# EasyEDA Pro project ProPrj_EBS_2026-01-24.epro

# Schematic Schematic1
Create Date: 2026-01-24; Page Name: P1; Project Name: EBS; Schematic Name: Schematic1; Update Date: 2026-01-25; Company: 嘉立创EDA; Page Size: A4; Version: V1.0
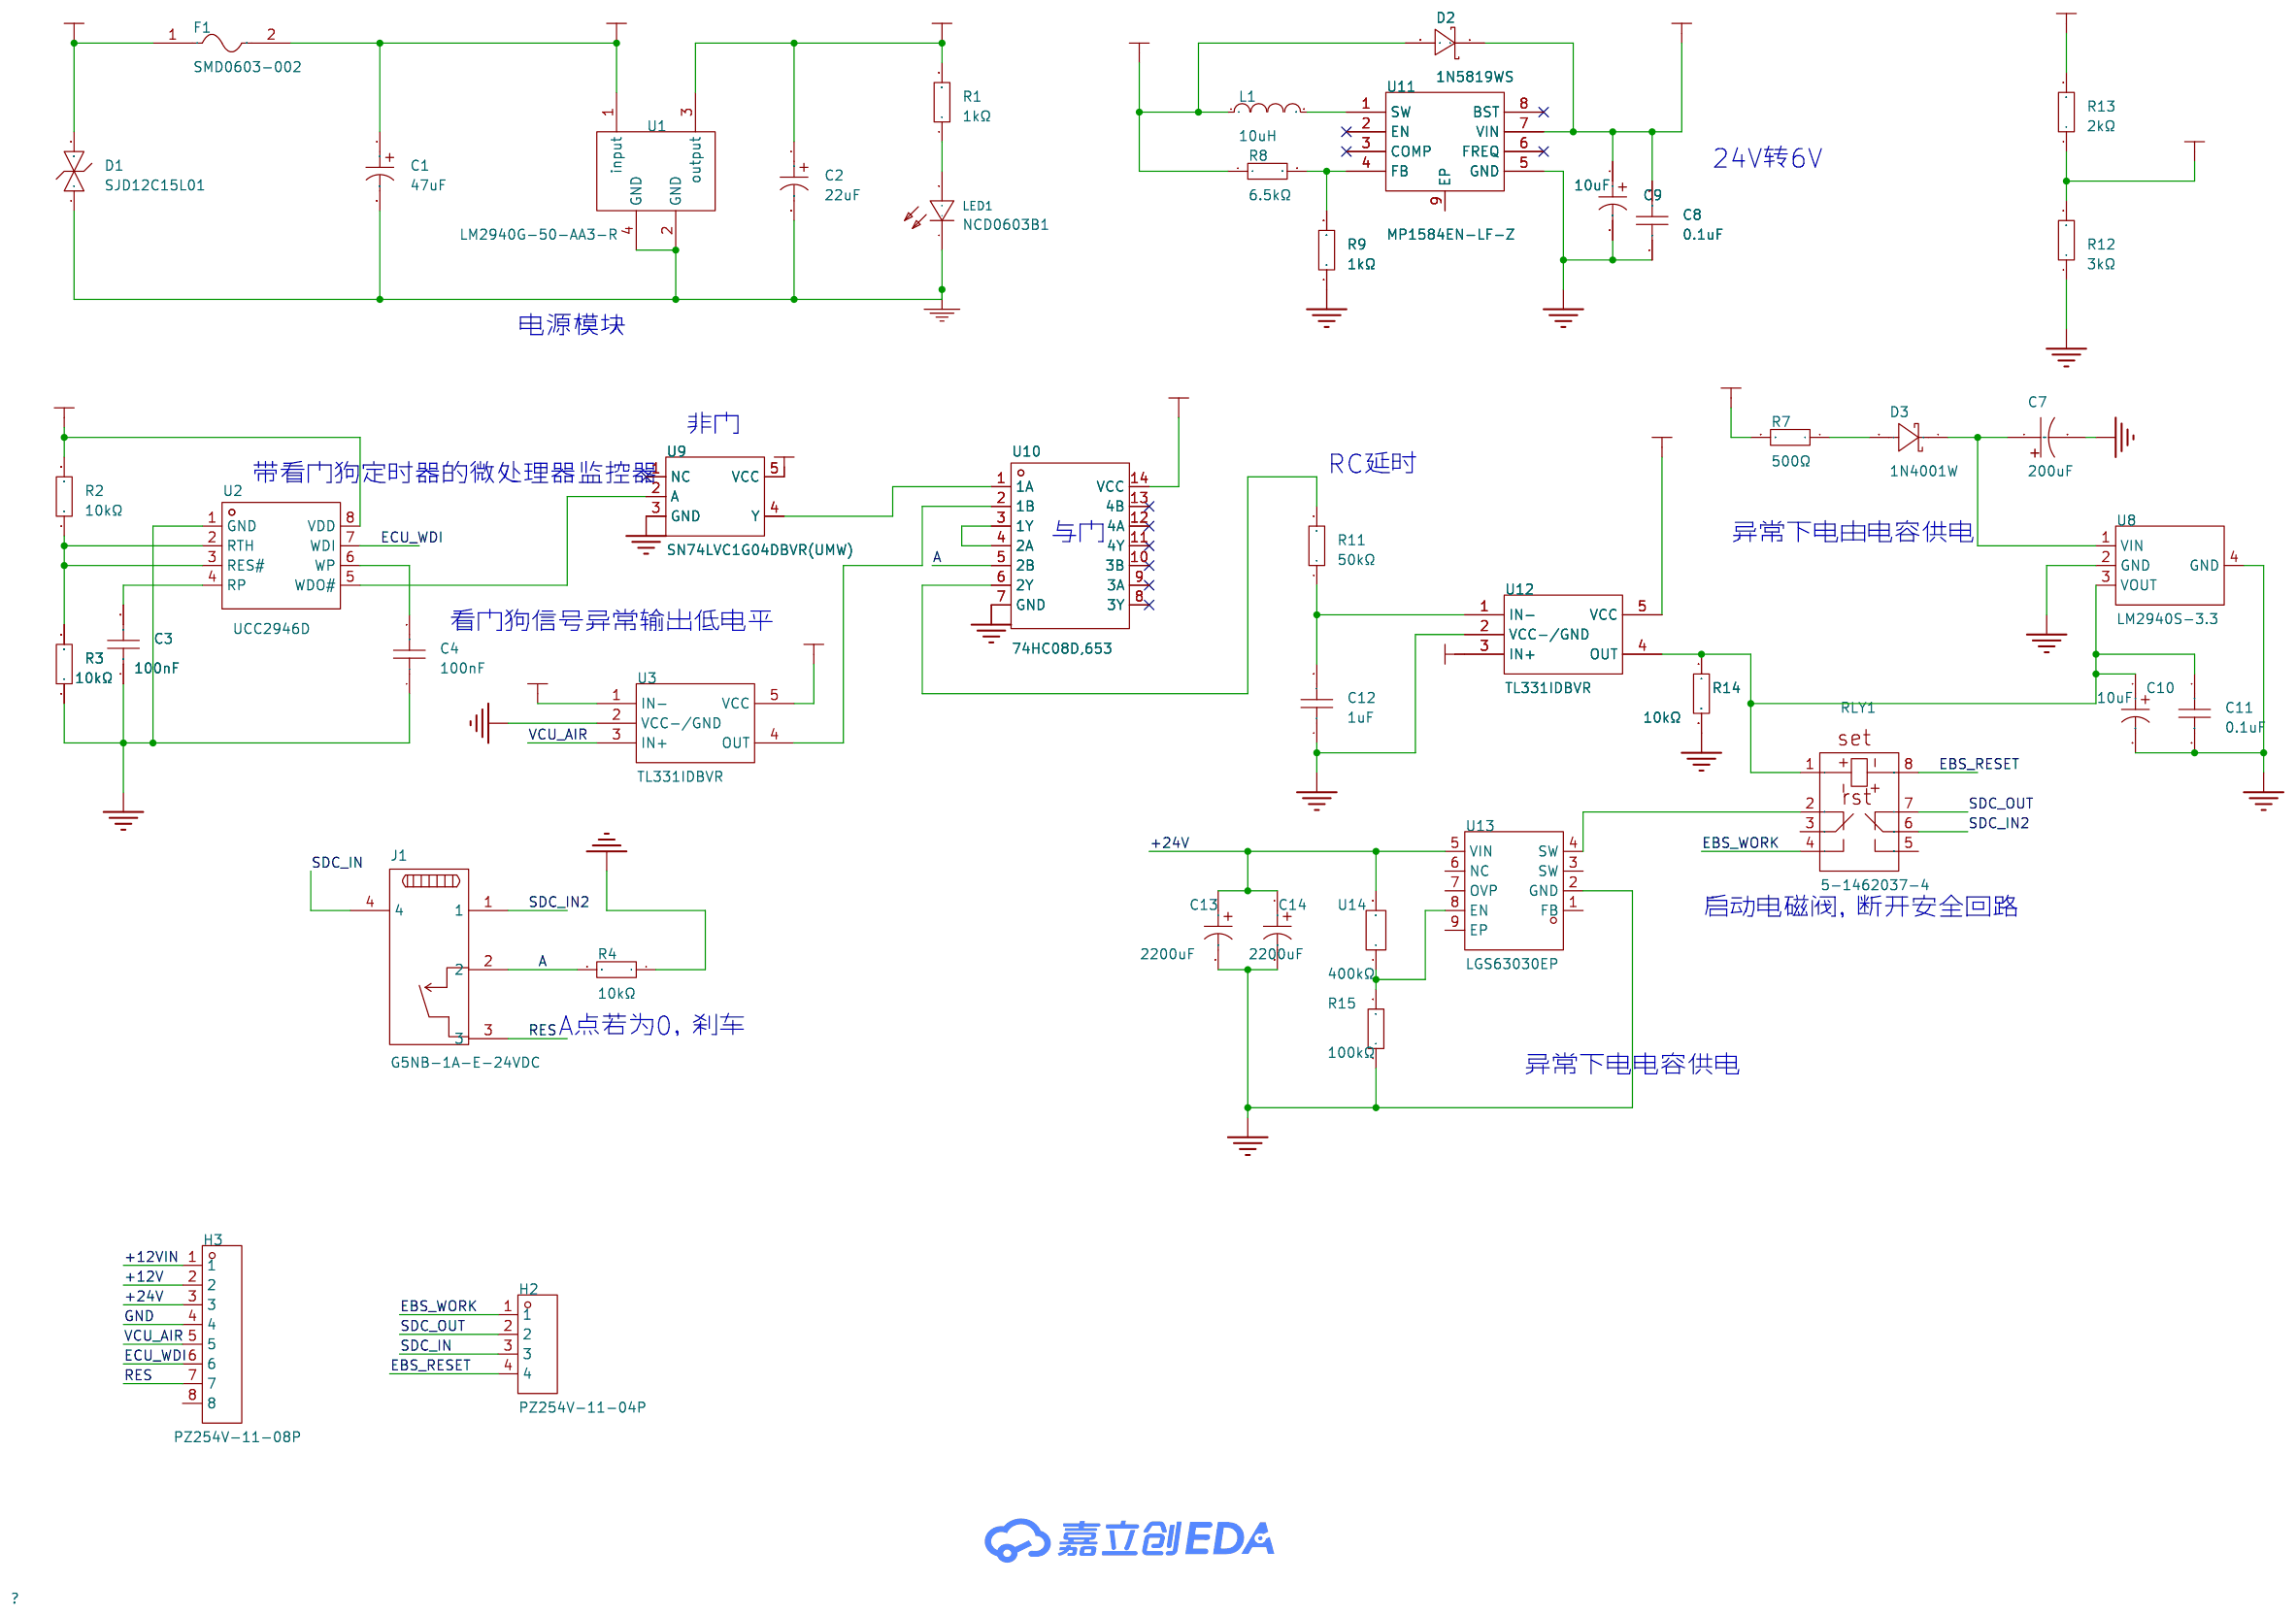
[diagram p0: schematic sheet]

## Parts
C1  47uF  [CAP-SMD_BD5.0-L5.3-W5.3-LS5.9-FD]
C2  22uF  [CAP-SMD_BD4.0-L4.3-W4.3-FD_1]
C3  100nF  [C0603]
C4  100nF  [C0603]
C7  200uF  [CAP-TH_BD12.5-P5.00-D0.6-FD]
C8  0.1uF  [C0603]
C9  10uF  [CAP-SMD_BD6.3-L6.6-W6.6-LS7.3-FD-H7.7]
C10  10uF  [CAP-SMD_BD6.3-L6.6-W6.6-LS7.3-FD-H7.7]
C11  0.1uF  [C0603]
C12  1uF  [C0603]
C13  2200uF  [CAP-SMD_BD16.0-L17.0-W17.0-FD]
C14  2200uF  [CAP-SMD_BD16.0-L17.0-W17.0-FD]
D1  SJD12C15L01  [SOD-123_L2.7-W1.6-LS3.7-BI]
D2  1N5819WS  [SOD-323_L1.8-W1.3-LS2.5-RD]
D3  1N4001W  [SOD-123FL_L2.7-W1.8-LS3.8-RD]
F1  SMD0603-002  [F0603]
H2  PZ254V-11-04P  [HDR-TH_4P-P2.54-V-M]
H3  PZ254V-11-08P  [HDR-TH_8P-P2.54-V-M]
J1  G5NB-1A-E-24VDC  [RELAY-TH_G5NB-1A-E-24VDC]
L1  10uH  [IND-SMD_L4.0-W4.0]
LED1  NCD0603B1  [LED0603-RD]
R1  1kΩ  [R0603]
R2  10kΩ  [R0603]
R3  10kΩ  [R0603]
R4  10kΩ  [R0603]
R7  500Ω  [R0603]
R8  6.5kΩ  [R0603]
R9  1kΩ  [R0603]
R11  50kΩ  [R0603]
R12  3kΩ  [R0603]
R13  2kΩ  [R0603]
R14  10kΩ  [R0603]
R15  100kΩ  [R0603]
RLY1  5-1462037-4  [RELAY-SMD_8P-L10.0-W6.0_IM43GR]
U1  LM2940G-50-AA3-R  [SOT-223-4_L6.5-W3.5-P2.30-LS7.0-BR]
U2  UCC2946D  [SOIC-8_L4.9-W3.9-P1.27-LS6.0-BL]
U3  TL331IDBVR  [SOT-23-5_L3.0-W1.7-P0.95-LS2.8-BR]
U8  LM2940S-3.3  [SOT-223-3_L6.5-W3.4-P2.30-LS7.0-BR]
U9  SN74LVC1G04DBVR(UMW)  [SOT-23-5_L3.0-W1.7-P0.95-LS2.8-BR]
U10  74HC08D,653  [SOIC-14_L8.7-W3.9-P1.27-LS6.0-BL]
U11  MP1584EN-LF-Z  [SOIC-8_L5.0-W4.0-P1.27-LS6.0-BL-EP2.0]
U12  TL331IDBVR  [SOT-23-5_L3.0-W1.7-P0.95-LS2.8-BR]
U13  LGS63030EP  [SOP-8_L4.9-W3.9-P1.27-LS6.0-TL-EP]
U14  400kΩ  [R0805]

## Library data of the parts
C1 = JVJ25V47M5x5: 容值:47uF;精度:±20%;额定电压:25V;纹波电流:35mA@120Hz;; LCSC Part Name: 47uF ±20% 25V; Supplier Part: C46550408; Manufacturer: JIERR(捷而瑞); Supplier Footprint: SMD,D5xL5.4mm; JLCPCB Part Class: 扩展库; Datasheet: https://item.szlcsc.com/datasheet/JVJ25V47M5x5/48680102.html; Supplier: LCSC; Tolerance: ±20%; Voltage Rating: 25V; Ripple Current: 35mA@120Hz; Diameter: 5mm; Height - Seated (Max): 5.4mm; Lifetime: 2000hrs@105℃; Operating Temperature: -55℃~+105℃
C2 = JVJ16V22M4X5: 容值:22uF;精度:±20%;额定电压:16V;纹波电流:20mA@120Hz;; LCSC Part Name: 22uF ±20% 16V; Supplier Part: C46550398; Manufacturer: JIERR(捷而瑞); Supplier Footprint: SMD,D4xL5.4mm; JLCPCB Part Class: 扩展库; Datasheet: https://item.szlcsc.com/datasheet/JVJ16V22M4X5/48680092.html; Supplier: LCSC; Tolerance: ±20%; Voltage Rating: 16V; Ripple Current: 20mA@120Hz; Diameter: 4mm; Height - Seated (Max): 5.4mm; Lifetime: 2000hrs@105℃; Operating Temperature: -55℃~+105℃
C3 C4 C8 C11 = CC0603KRX7R9BB104: 容值:100nF;精度:±10%;额定电压:50V;温度系数:X7R;; LCSC Part Name: 100nF ±10% 50V; Supplier Part: C14663; Manufacturer: YAGEO(国巨); Supplier Footprint: 0603; JLCPCB Part Class: 基础库; Datasheet: https://item.szlcsc.com/datasheet/CC0603KRX7R9BB104/15331.html; Supplier: LCSC; Tolerance: ±10%; Voltage Rating: 50V; Temperature Coefficient: X7R
C7 = LKML1602A201MF: 容值:200uF;精度:±20%;额定电压:100V;纹波电流:-;等效串联电阻(ESR):-;; LCSC Part Name: 200uF ±20% 100V; Supplier Part: C443147; Manufacturer: Ymin(永铭); Supplier Footprint: 插件,D12.5xL16mm; JLCPCB Part Class: 扩展库; Supplier: LCSC; Tolerance: ±20%; Voltage Rating: 100V; Pin Spacing: 5mm; Diameter: 12.5mm; Height - Seated (Max): 16mm; Lifetime: 10000hrs@105℃
C9 C10 = JVJ50V100M6x8: 容值:100uF;精度:±20%;额定电压:50V;纹波电流:140mA@120Hz;; LCSC Part Name: 100uF ±20% 50V; Supplier Part: C46550415; Manufacturer: JIERR(捷而瑞); Supplier Footprint: SMD,D6.3xL7.7mm; JLCPCB Part Class: 扩展库; Datasheet: https://item.szlcsc.com/datasheet/JVJ50V100M6x8/48680109.html; Supplier: LCSC; Tolerance: ±20%; Voltage Rating: 50V; Ripple Current: 140mA@120Hz; Diameter: 6.3mm; Height - Seated (Max): 7.7mm; Lifetime: 2000hrs@105℃; Operating Temperature: -55℃~+105℃
C12 = CGA0603X5R105K500JT: 容值:1uF;精度:±10%;额定电压:50V;温度系数:X5R;; LCSC Part Name: 1uF ±10% 50V; Supplier Part: C6119852; Manufacturer: HRE(芯声); Supplier Footprint: 0603; JLCPCB Part Class: 扩展库; Datasheet: https://item.szlcsc.com/datasheet/CGA0603X5R105K500JT/7062558.html; Supplier: LCSC; Tolerance: ±10%; Voltage Rating: 50V; Temperature Coefficient: X5R
C13 C14 = JVJ25V2200M16X16: 容值:2200uF;精度:±20%;额定电压:25V;纹波电流:900mA@120Hz;; LCSC Part Name: 2200uF ±20% 25V; Supplier Part: C49256852; Manufacturer: JIERR(捷而瑞); Supplier Footprint: SMD,D16xL16.5mm; JLCPCB Part Class: 扩展库; Datasheet: https://item.szlcsc.com/datasheet/JVJ25V2200M16X16/51692252.html; Supplier: LCSC; Tolerance: ±20%; Voltage Rating: 25V; Ripple Current: 900mA@120Hz; Diameter: 16mm; Height - Seated (Max): 16.5mm; Lifetime: 2000hrs@105℃
D1 = SJD12C15L01: 反向截止电压(Vrwm):15V;击穿电压(VBR):16.7V;峰值脉冲电流(Ipp)@8/20us:8.2A;钳位电压(Vc)@Ipp:24.4V;; Supplier Part: C78437; Manufacturer: Brightking(君耀电子); Supplier Footprint: SOD-123; JLCPCB Part Class: Extended Part; Datasheet: https://atta.szlcsc.com/upload/public/pdf/source/20160709/1468031891025.pdf; Supplier: LCSC; Reverse Stand-Off Voltage (Vrwm): 15V; Breakdown Voltage (VBR): 16.7V; Peak Pulse Current(Ipp)@8/20us: 8.2A; Clamping Voltage@Ipp: 24.4V
D2 = 1N5819WS_C191023: 正向压降(Vf):600mV@1A;直流反向耐压(Vr):40V;整流电流:1A;; LCSC Part Name: 电压:40V 电流:1A; Supplier Part: C191023; Manufacturer: Hottech(合科泰); Supplier Footprint: SOD-323; JLCPCB Part Class: 基础库; Datasheet: https://item.szlcsc.com/datasheet/1N5819WS/213850.html; Supplier: LCSC; Voltage - Forward(Vf@If): 600mV@1A; Voltage - DC Reverse(Vr): 40V; Current - Rectified: 1A; Non-Repetitive Peak Forward Surge Current: 25A
D3 = 1N4001W_C18199085: 二极管配置:独立式;正向压降(Vf):1V@1.0A;直流反向耐压(Vr):50V;整流电流:1A;; Supplier Part: C18199085; Manufacturer: R+O(宏嘉诚); Supplier Footprint: SOD-123FL; JLCPCB Part Class: 扩展库; Datasheet: https://item.szlcsc.com/datasheet/1N4001W/19354317.html; Supplier: LCSC; Diode Configuration: 独立式; Voltage - Forward(Vf@If): 1V@1.0A; Voltage - DC Reverse(Vr): 50V; Current - Rectified: 1A; Reverse Leakage Current (Ir): 2uA@50V; Non-Repetitive Peak Forward Surge Current: 30A; Operating Junction Temperature Range: -55℃~+150℃
F1 = SMD0603-002: 30V,0.02A; LCSC Part Name: 20mA,30V; Supplier Part: C3646886; Manufacturer: 台湾陆海; Supplier Footprint: 0603; JLCPCB Part Class: Extended Part; Datasheet: https://atta.szlcsc.com/upload/public/pdf/source/20230404/20B4F423E9D21310C61C06C0FA62271A.pdf; Supplier: LCSC
H2 = PZ254V-11-04P: 插针结构:1x4P;间距:2.54mm;行距:-;圆针/方针:方针;安装方式:直插;排数:单排;总PIN位数:4P;额定电流:3A;额定电压:250V;配合针长度:6mm;塑高:2.5mm;端接针长度:3mm;触头材质:-;工作温度:-40℃~+105℃;颜色:黑色;; LCSC Part Name: 1x4P 间距:2.54mm 方针 直插; Supplier Part: C2691448; Manufacturer: XFCN(兴飞); Supplier Footprint: 插件,P=2.54mm; JLCPCB Part Class: 扩展库; Datasheet: https://item.szlcsc.com/datasheet/PZ254V-11-04P/2801085.html; Supplier: LCSC; Pin Structure: 1x4P; Pitch: 2.54mm; Circluar Pins/Square Pins: 方针; Mounting Type: 直插; Number of Rows: 单排; Number of Pins: 4P; Current Rating: 3A; Voltage Rating (Max): 250V; Length of Mating Pin: 6mm; Insulation Height: 2.5mm; Length of End Connection Pin: 3mm; Operating Temperature: -40℃~+105℃; Color: 黑色
H3 = PZ254V-11-08P: 插针结构:1x8P;间距:2.54mm;行距:-;圆针/方针:方针;安装方式:直插;排数:单排;总PIN位数:8P;额定电流:-;额定电压:-;配合针长度:6mm;塑高:2.5mm;端接针长度:3mm;触头材质:黄铜;触头镀层:-;工作温度:-40℃~+105℃;颜色:黑色;; LCSC Part Name: 1x8P 间距:2.54mm 方针 直插; Supplier Part: C492407; Manufacturer: XFCN(兴飞); Supplier Footprint: 插件,P=2.54mm; JLCPCB Part Class: 扩展库; Datasheet: https://item.szlcsc.com/datasheet/PZ254V-11-08P/502963.html; Supplier: LCSC; Pin Structure: 1x8P; Pitch: 2.54mm; Circluar Pins/Square Pins: 方针; Mounting Type: 直插; Number of Rows: 单排; Number of Pins: 8P; Length of Mating Pin: 6mm; Insulation Height: 2.5mm; Length of End Connection Pin: 3mm; Contact Material: 黄铜; Operating Temperature: -40℃~+105℃; Color: 黑色
J1 = G5NB-1A-E-24VDC: 线圈电压:24V;触点形式:一组常开:1A(单刀单掷-常开);触点容量(电阻负载):5A@250VAC；3A@30VDC;最大切换电压:250V@AC；30V@DC;最大切换电流:5A;; LCSC Part Name: 功率继电器 耐冲击电压10kV的1极3A开闭的小型继电器; Supplier Part: C34758; Manufacturer: OMRON(欧姆龙); Supplier Footprint: 插件,20.4x7mm; JLCPCB Part Class: 扩展库; Datasheet: https://item.szlcsc.com/datasheet/G5NB-1A-E-24VDC/35729.html; Supplier: LCSC; Coil Voltage: 24V; Contact Form: 一组常开:1A(单刀单掷-常开); Number of Pins: 4; Contact Rating: 5A@250VAC；3A@30VDC; Switching Voltage(Max): 250V@AC；30V@DC; Coil Rated Power: 200mW; Contact Material: 银合金(无镉); Switching Current(Max): 5A; Coil Type: 无极性-单线圈; Coil Resistance: 2.88kΩ; Contact Resistance: 100mΩ; Operate Time: 10ms; Release Time: 10ms; Operating Temperature: -40℃~+85℃
L1 = FHD4020S-100MT: 电感值:10uH;精度:±20%;额定电流:2.35A;饱和电流(Isat):3.5A;类型:-;; LCSC Part Name: 10uH ±20% 3.5A; Supplier Part: C602032; Manufacturer: cjiang(长江微电); Supplier Footprint: SMD,4x4mm; JLCPCB Part Class: 扩展库; Datasheet: https://item.szlcsc.com/datasheet/FHD4020S-100MT/631462.html; Supplier: LCSC; Tolerance: ±20%; Current Rating: 2.35A; Current - Saturation(Isat): 3.5A; DC Resistance(DCR): 190mΩ
LED1 = NCD0603B1: 发光颜色:蓝灯;; LCSC Part Name: 蓝灯; Supplier Part: C84266; Manufacturer: 国星光电; Supplier Footprint: 0603; JLCPCB Part Class: 扩展库; Datasheet: https://atta.szlcsc.com/upload/public/pdf/source/20200820/C84266_6A3CDBEFA72C6CAD68EDA53474ADAE6C.pdf; Supplier: LCSC; Emitted Color: 蓝灯
R1 R4 R7-R9 = 0603WAF1001T5E: 电阻类型:厚膜电阻;阻值:1kΩ;精度:±1%;功率:100mW;; LCSC Part Name: 1kΩ ±1% 100mW; Supplier Part: C21190; Manufacturer: UNI-ROYAL(厚声); Supplier Footprint: 0603; JLCPCB Part Class: Basic Part; Datasheet: https://atta.szlcsc.com/upload/public/pdf/source/20200306/C422600_1E6D84923E4A46A82E41ADD87F860B5C.pdf; Supplier: LCSC; Type: 厚膜电阻; Tolerance: ±1%; Power(Watts): 100mW; Temperature Coefficient: ±100ppm/℃; Overload Voltage (Max): 75V; Operating Temperature Range: -55℃~+155℃
R2 R3 R14 = 0603WAF1002T5E: 电阻类型:厚膜电阻;阻值:10kΩ;精度:±1%;功率:100mW;工作电压:75V;温度系数:±100ppm/℃;; LCSC Part Name: 厚膜电阻 10kΩ ±1% 100mW; Supplier Part: C25804; Manufacturer: UNI-ROYAL(厚声); Supplier Footprint: 0603; JLCPCB Part Class: 基础库; Datasheet: https://item.szlcsc.com/datasheet/0603WAF1002T5E/26547.html; Supplier: LCSC; Type: 厚膜电阻; Tolerance: ±1%; Power(Watts): 100mW; Voltage-Supply(Max): 75V; Temperature Coefficient: ±100ppm/℃; Operating Temperature: -55℃~+155℃
R11 = AR03BTC5002A: 电阻类型:薄膜电阻;阻值:50kΩ;精度:±0.1%;功率:62.5mW;工作电压:50V;温度系数:±25ppm/℃;; LCSC Part Name: 50kΩ ±0.1% 62.5mW; Supplier Part: C304067; Manufacturer: Viking(光颉); Supplier Footprint: 0603; JLCPCB Part Class: 扩展库; Datasheet: https://item.szlcsc.com/datasheet/AR03BTC5002A/288134.html; Supplier: LCSC; Type: 薄膜电阻; Tolerance: ±0.1%; Power(Watts): 62.5mW; Voltage-Supply(Max): 50V; Temperature Coefficient: ±25ppm/℃; Operating Temperature: -55℃~+155℃
R12 = 0603WAF3001T5E: 电阻类型:厚膜电阻;阻值:3kΩ;精度:±1%;功率:100mW;工作电压:75V;温度系数:±100ppm/℃;; LCSC Part Name: 3kΩ ±1% 100mW 厚膜电阻; Supplier Part: C4211; Manufacturer: UNI-ROYAL(厚声); Supplier Footprint: 0603; JLCPCB Part Class: 基础库; Datasheet: https://item.szlcsc.com/datasheet/0603WAF3001T5E/4618.html; Supplier: LCSC; Type: 厚膜电阻; Tolerance: ±1%; Power(Watts): 100mW; Voltage-Supply(Max): 75V; Temperature Coefficient: ±100ppm/℃; Operating Temperature: -55℃~+155℃
R13 = 0603WAF2001T5E: 电阻类型:厚膜电阻;阻值:2kΩ;精度:±1%;功率:100mW;工作电压:75V;温度系数:±100ppm/℃;; LCSC Part Name: 2kΩ ±1% 100mW 厚膜电阻; Supplier Part: C22975; Manufacturer: UNI-ROYAL(厚声); Supplier Footprint: 0603; JLCPCB Part Class: 基础库; Datasheet: https://item.szlcsc.com/datasheet/0603WAF2001T5E/23702.html; Supplier: LCSC; Type: 厚膜电阻; Tolerance: ±1%; Power(Watts): 100mW; Voltage-Supply(Max): 75V; Temperature Coefficient: ±100ppm/℃; Operating Temperature: -55℃~+155℃
R15 = 0603WAF1003T5E: 电阻类型:厚膜电阻;阻值:100kΩ;精度:±1%;功率:100mW;工作电压:75V;温度系数:±100ppm/℃;; LCSC Part Name: 100kΩ ±1% 100mW 厚膜电阻; Supplier Part: C25803; Manufacturer: UNI-ROYAL(厚声); Supplier Footprint: 0603; JLCPCB Part Class: 基础库; Datasheet: https://item.szlcsc.com/datasheet/0603WAF1003T5E/26546.html; Supplier: LCSC; Type: 厚膜电阻; Tolerance: ±1%; Power(Watts): 100mW; Voltage-Supply(Max): 75V; Temperature Coefficient: ±100ppm/℃; Operating Temperature: -55℃~+155℃
RLY1 = 5-1462037-4: 线圈电压:3V;触点形式:两组转换:2C(双刀双掷-转换);触点容量(电阻负载):-;最大切换电压:250V@AC；220V@DC;最大切换电流:2A;; LCSC Part Name: 3V 2A 两组转换:2C(双刀双掷-转换); Supplier Part: C377684; Manufacturer: TE Connectivity(泰科电子); Supplier Footprint: SMD,10x6mm; JLCPCB Part Class: 扩展库; Datasheet: https://item.szlcsc.com/datasheet/5-1462037-4/350541.html; Supplier: LCSC; Coil Voltage: 3V; Contact Form: 两组转换:2C(双刀双掷-转换); Switching Voltage(Max): 250V@AC；220V@DC; Coil Type: 单线圈; Switching Current(Max): 2A; Operate Time: 3ms; Release Time: 3ms; Operating Temperature: -40℃~+85℃
U1 = LM2940G-50-AA3-R: 输出类型:固定;输出极性:正;输出通道数:1;最大输入电压:26V;输出电压:5V;压差:800mV@(1A);输出电流:1A;电源纹波抑制比(PSRR):72dB@(120Hz);; LCSC Part Name: 正 Vin=26V Vout=5V 1A 72dB@(120Hz); Supplier Part: C71094; Manufacturer: UTC(友顺); Supplier Footprint: SOT-223-4; JLCPCB Part Class: Extended Part; Datasheet: https://atta.szlcsc.com/upload/public/pdf/source/20160416/1460799393051.pdf; Supplier: LCSC; Output Type: 固定; Output Polarity: 正; Number of Outputs: 1; Maximum Input Voltage: 26V; Output Voltage: 5V; Dropout Voltage: 800mV@(1A); Output Current: 1A; Power Supply Rejection Ratio (PSRR): 72dB@(120Hz)
U2 = UCC2946D: UCC2946 带看门狗定时器的微处理器监控器; Supplier Part: C201595; Manufacturer: TI(德州仪器); Supplier Footprint: SOIC-8-150mil; JLCPCB Part Class: Extended Part; Datasheet: https://atta.szlcsc.com/upload/public/pdf/source/20180403/C201595_D3812EC184F420028838D56EDBFF7A55.pdf; Supplier: LCSC; Output Type: 推挽; Reset Active Level: 低电平有效; Number of Voltages Monitored: 1; Reset Timeout: 140ms; Operating Temperature: -40℃~+85℃@(TA)
U3 U12 = TL331IDBVR: 比较器数:单路;输入失调电压(Vos):2mV;输入偏置电流(Ib):25nA;轨到轨:轨到轨输入;; LCSC Part Name: 单通道差分比较器; Supplier Part: C80942; Manufacturer: TI(德州仪器); Supplier Footprint: SOT-23-5; JLCPCB Part Class: 扩展库; Datasheet: https://www.ti.com/cn/lit/gpn/tl331; Supplier: LCSC; Number of Channels: 单路; Vos - Input Offset Voltage: 2mV; Ib - Input Bias Current: 25nA; Propagation Delay Time: 1.3us; Output Type: 开漏; Output Mode: TTL；MOS；CMOS; Rail to Rail: 轨到轨输入; Quiescent Current: 400uA; Operating Temperature: -40℃~+85℃; Maximum Power Supply Range (Vdd-Vss): 36V; Single Supply: 2V~36V; Input Offset Current(Ios): 5nA; Response Time (tr): 1.3us
U8 = LM2940S-3.3: 输出类型:固定;工作电压:26V;输出电压:3.3V;输出电流:1A;电源纹波抑制比(PSRR):-;输出极性:正极;; LCSC Part Name: 1A低压差线性稳压器; Supplier Part: C596335; Manufacturer: HTC; Supplier Footprint: SOT-223-3L; JLCPCB Part Class: 扩展库; Datasheet: https://item.szlcsc.com/datasheet/LM2940S-3.3/624379.html; Supplier: LCSC; Output Type: 固定; Voltage - Supply: 26V; Output Voltage: 3.3V; Output Current: 1A; Voltage Dropout: 630mV@(1A); standby current: 500uA; Features: 反接保护；过流保护；过热保护; Operating Temperature: -40℃~+85℃@(Tj); Output Configuration: 正极; Number of Outputs: 1
U9 = SN74LVC1G04DBVR(UMW): 工作电压:1.65V~5.5V;静态电流(Iq):10uA;; LCSC Part Name: 门极和反相器; Supplier Part: C434067; Manufacturer: UMW(友台半导体); Supplier Footprint: SOT-23-5; JLCPCB Part Class: 扩展库; Datasheet: https://item.szlcsc.com/datasheet/SN74LVC1G04DBVR(UMW)/431036.html; Supplier: LCSC; Voltage - Supply: 1.65V~5.5V; Quiescent Current(Iq): 10uA; Current - Output Low(IOL): 32mA; Current - Output High(IOH): 32mA; Operating Temperature: -40℃~+105℃
U10 = 74HC08D,653: 逻辑类型:与门;通道数:4;工作电压:2V~6V;静态电流(Iq):2uA;传播延迟(tpd):27ns@4.5V,50pF;; LCSC Part Name: 四路二输入与门; Supplier Part: C5593; Manufacturer: Nexperia(安世); Supplier Footprint: SOIC-14; JLCPCB Part Class: 扩展库; Datasheet: https://item.szlcsc.com/datasheet/74HC08D%252C653/6044.html; Supplier: LCSC; Logic Type: 与门; Number of Channels: 4; Voltage - Supply: 2V~6V; Quiescent Current: 2uA; Current - Output Low(IOL): 5.2mA; Current - Output High(IOH): 5.2mA; Input Logic Level - High: 1.5V~4.2V; Input Logic Level - Low: 500mV~1.8V; Output Logic Level - High: 3.7V；1.9V；5.2V; Output Logic Level - Low: 100mV；400mV; Series: 74HC系列; Propagation Delay: 27ns@4.5V,50pF; Operating Temperature: -40℃~+125℃; Input Number: 2
U11 = MP1584EN-LF-Z: 功能类型:降压型;工作电压:4.5V~28V;输出电压:800mV~25V;输出电流:3A;输出类型:可调;; LCSC Part Name: 3A、1.5MHz、28V降压转换器; Supplier Part: C15051; Manufacturer: MPS(芯源); Supplier Footprint: SOIC-8-EP; JLCPCB Part Class: 扩展库; Datasheet: https://item.szlcsc.com/datasheet/MP1584EN-LF-Z/15724.html; Supplier: LCSC; Function: 降压型; Voltage - Supply: 4.5V~28V; Output Voltage: 800mV~25V; Output Current: 3A; Frequency - Switching: 100kHz~1.5MHz; Operating Temperature: -20℃~+85℃@(TA); Synchronous Rectifier: 否; Number of Outputs: 1; Topology: 降压式; Quiescent Current: 100uA; Switch tube (built-in/external): 内置; Output Type: 可调
U13 = LGS63030EP: 类型:DC-DC恒流驱动;输入电压:3V~60V;开关频率:1.2MHz;通道数:1;输出电压:3V~60V;输出电流:500mA;调光:模拟;拓扑结构:升压;; LCSC Part Name: 输出0.5A 模拟调光 升压型驱动; Supplier Part: C5280694; Manufacturer: Legend-Si(棱晶半导体); Supplier Footprint: ESOP-8; JLCPCB Part Class: 扩展库; Datasheet: https://atta.szlcsc.com/upload/public/pdf/source/20230407/0B3DA463F32E370DFD87A7123EAFA503.pdf; Supplier: LCSC; Type: DC-DC恒流驱动; Input Voltage: 3V~60V; Switch Frequency: 1.2MHz; Channels: 1; Output Voltage: 3V~60V; Output Current: 500mA; Dimming: 模拟; Topology: 升压; Operating temperature: -40℃~+125℃
U14 = AR05BTCW4003: 阻值:400kΩ;精度:±0.1%;功率:125mW;温度系数:±25ppm/℃;; LCSC Part Name: 400kΩ ±0.1% 125mW; Supplier Part: C3013969; Manufacturer: Viking(光颉); Supplier Footprint: 0805; JLCPCB Part Class: 扩展库; Datasheet: https://item.szlcsc.com/datasheet/AR05BTCW4003/3522639.html; Supplier: LCSC; Tolerance: ±0.1%; Power(Watts): 125mW; Temperature Coefficient: ±25ppm/℃

## Nets
12VIN: D1.2 F1.1
+3V: R12.2 R13.1 U12.3(IN+) U12.5(VCC)
+5V: C2.1 R1.2 R2.2 R13.2 U1.3(output) U2.8(VDD) U3.5(VCC) U9.5(VCC) U10.14(VCC)
+6V: D2.2(A) L1.1 R8.1 U3.1(IN-)
+12V: C1.1 F1.2 H3.2 R7.2 U1.1(input)
+12VIN: H3.1
+24V: C8.1 C9.1 C13.1 C14.1 D2.1(K) H3.3 U11.7(VIN) U13.5(VIN) U14.2
GND: C1.2 C2.2 C3.1 C4.1 C7.2 C8.2 C9.2 C10.2 C11.2 C12.1 C13.2 C14.2 D1.1 H3.4 LED1.1(-) R3.1 R4.1 R9.1 R12.1 R14.2 R15.1 U1.2(GND) U1.4(GND) U2.1(GND) U3.2(VCC-/GND) U8.2(GND) U8.4(GND) U9.3(GND) U10.7(GND) U11.5(GND) U12.2(VCC-/GND) U13.2(GND)
A: J1.2 R4.2 U10.5(2B)
EBS_RESET: H2.4 RLY1.8
EBS_WORK: H2.1 RLY1.4
ECU_WDI: H3.6 U2.7(WDI)
RES: H3.7 J1.3
SDC_IN: H2.3 J1.4
SDC_IN2: J1.1 RLY1.6
SDC_OUT: H2.2 RLY1.7
VCU_AIR: H3.5 U3.3(IN+)
Net-(C3-2): C3.2 U2.4(RP)
Net-(C4-2): C4.2 U2.6(WP)
Net-(C7-1): C7.1 D3.1(K) U8.1(VIN)
Net-(C10-1): C10.1 C11.1 R14.1 RLY1.1 U8.3(VOUT) U12.4(OUT)
Net-(C12-2): C12.2 R11.1 U12.1(IN-)
Net-(D3-2): D3.2(A) R7.1
Net-(L1-2): L1.2 U11.1(SW)
Net-(LED1-2): LED1.2(+) R1.1
Net-(R2-1): R2.1 R3.2 U2.2(RTH) U2.3(RES#)
Net-(R8-2): R8.2 R9.2 U11.4(FB)
Net-(R11-2): R11.2 U10.6(2Y)
Net-(R15-2): R15.2 U13.8(EN) U14.1
Net-(RLY1-2): RLY1.2 U13.4(SW)
Net-(U2-5): U2.5(WDO#) U9.2(A)
Net-(U3-4): U3.4(OUT) U10.2(1B)
Net-(U9-4): U9.4(Y) U10.1(1A)
Net-(U10-3): U10.3(1Y) U10.4(2A)

Not connected (* = marked no-connect by the designer): H3 8; RLY1 3 5; U9 1(NC)*; U10 8(3Y)* 9(3A)* 10(3B)* 11(4Y)* 12(4A)* 13(4B)*; U11 2(EN)* 3(COMP)* 6(FREQ)* 8(BST)* 9(EP); U13 1(FB) 3(SW) 6(NC) 7(OVP) 9(EP)

## Notes on the sheet
- 24V转6V
- 电源模块
- 非门
- 带看门狗定时器的微处理器监控器
- RC延时
- 与门
- 异常下电由电容供电
- 看门狗信号异常输出低电平
- 启动电磁阀，断开安全回路
- A点若为0，刹车
- 异常下电电容供电
